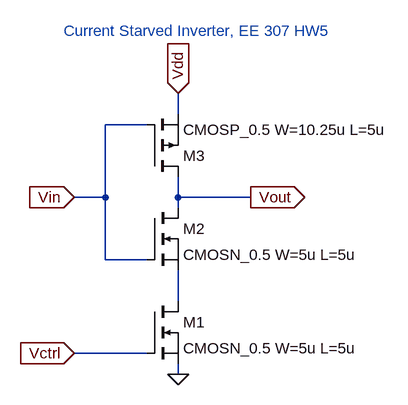
[diagram p0: schematic current_starved_inverter.asc]
current_starved_inverter.asc, the LTspice schematic file:
Version 4
SHEET 1 880 680
WIRE 272 -48 272 -80
WIRE 224 -32 160 -32
WIRE 160 80 160 -32
WIRE 160 80 112 80
WIRE 272 80 272 48
WIRE 384 80 272 80
WIRE 272 96 272 80
WIRE 160 176 160 80
WIRE 224 176 160 176
WIRE 272 240 272 192
WIRE 224 320 112 320
WIRE 272 352 272 336
FLAG 272 -80 Vdd
IOPIN 272 -80 In
FLAG 112 80 Vin
IOPIN 112 80 In
FLAG 112 320 Vctrl
IOPIN 112 320 In
FLAG 272 352 0
FLAG 384 80 Vout
IOPIN 384 80 Out
SYMBOL nmos 224 240 R0
SYMATTR InstName M1
SYMATTR Value CMOSN_0.5 W=5u L=5u
SYMBOL nmos 224 96 R0
SYMATTR InstName M2
SYMATTR Value CMOSN_0.5 W=5u L=5u
SYMBOL pmos 224 48 M180
SYMATTR InstName M3
SYMATTR Value CMOSP_0.5 W=10.25u L=5u
TEXT 96 -176 Left 2 ;Current Starved Inverter, EE 307 HW5

The netlist it stands for:
* current_starved_inverter.asc
M1 N001 Vctrl 0 0 CMOSN_0.5 W=5u L=5u
M2 Vout Vin N001 N001 CMOSN_0.5 W=5u L=5u
M3 Vout Vin Vdd Vdd CMOSP_0.5 W=10.25u L=5u
.model NMOS NMOS
.model PMOS PMOS
.lib standard.mos
* Current Starved Inverter, EE 307 HW5
.backanno
.end